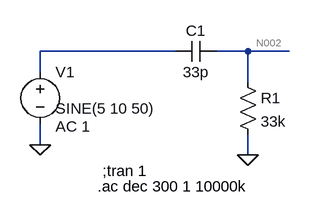
[diagram p0: schematic HPF.asc]
HPF.asc, the LTspice schematic file:
Version 4
SHEET 1 880 680
WIRE 112 112 -96 112
WIRE 224 112 176 112
WIRE 288 112 224 112
WIRE -96 144 -96 112
WIRE 224 160 224 112
WIRE -96 256 -96 224
WIRE 224 272 224 240
FLAG 224 272 0
FLAG -96 256 0
SYMBOL cap 176 96 R90
WINDOW 0 0 32 VBottom 2
WINDOW 3 32 32 VTop 2
SYMATTR InstName C1
SYMATTR Value 33p
SYMBOL res 208 144 R0
SYMATTR InstName R1
SYMATTR Value 33k
SYMBOL voltage -96 128 R0
WINDOW 3 24 72 Left 2
WINDOW 123 24 100 Left 2
WINDOW 39 0 0 Left 0
SYMATTR Value SINE(5 10 50)
SYMATTR Value2 AC 1
SYMATTR InstName V1
TEXT 0 296 Left 2 !;tran 1
TEXT -8 320 Left 2 !.ac dec 300 1 10000k

The netlist it stands for:
* HPF.asc
C1 N002 N001 33p
R1 N002 0 33k
V1 N001 0 SINE(5 10 50) AC 1
;tran 1
.ac dec 300 1 10000k
.backanno
.end

* Results of the author's LTspice run, read from the files saved beside the schematic
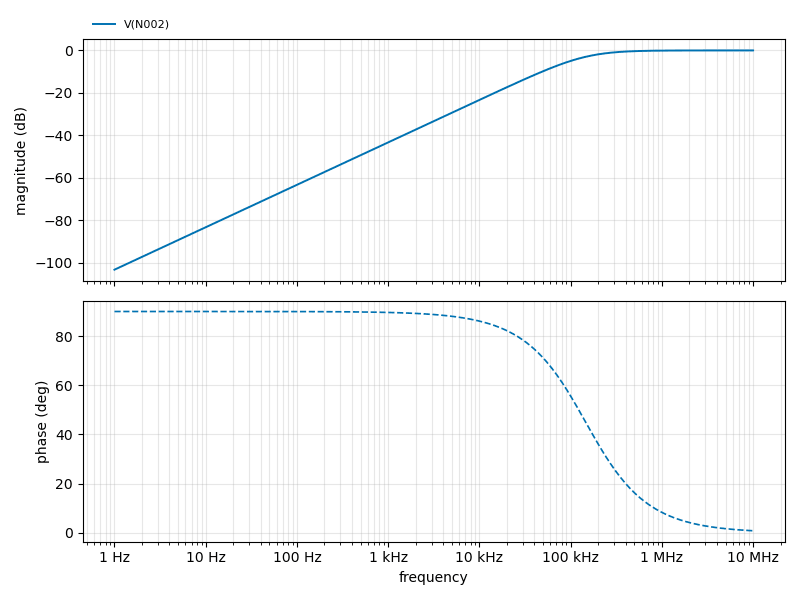
[diagram p1: AC Analysis of HPF.asc, plotted from the saved traces]
* AC Analysis, 1 run:
*   V(N002): -103.30 dB at 1 Hz, -0.00 dB at 10 MHz, peak -0.00 dB at 10 MHz, 3 dB below the peak at 146.1 kHz